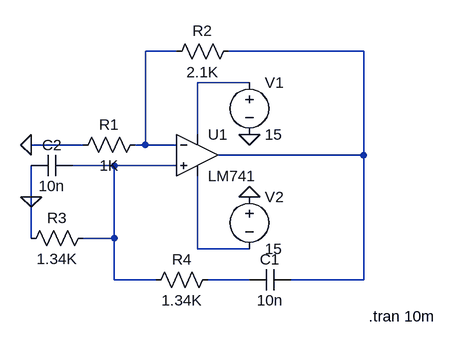
[diagram p0: schematic wein bridge (working).asc]
wein bridge (working).asc, the LTspice schematic file:
Version 4
SHEET 1 880 680
WIRE 336 144 288 144
WIRE 624 144 416 144
WIRE 448 192 368 192
WIRE 368 272 368 192
WIRE 192 288 112 288
WIRE 288 288 288 144
WIRE 288 288 272 288
WIRE 336 288 288 288
WIRE 624 304 624 144
WIRE 624 304 400 304
WIRE 240 320 176 320
WIRE 336 320 240 320
WIRE 112 368 112 320
WIRE 112 432 112 368
WIRE 240 432 240 320
WIRE 240 432 192 432
WIRE 368 448 368 336
WIRE 448 448 368 448
WIRE 240 496 240 432
WIRE 304 496 240 496
WIRE 448 496 384 496
WIRE 624 496 624 304
WIRE 624 496 512 496
FLAG 112 368 0
FLAG 112 288 0
FLAG 448 368 0
FLAG 448 272 0
SYMBOL LM741 368 240 R0
SYMATTR InstName U1
SYMBOL voltage 448 176 R0
SYMATTR InstName V1
SYMATTR Value 15
SYMBOL voltage 448 352 R0
SYMATTR InstName V2
SYMATTR Value 15
SYMBOL cap 512 480 R90
WINDOW 0 0 32 VBottom 2
WINDOW 3 32 32 VTop 2
SYMATTR InstName C1
SYMATTR Value 10n
SYMBOL cap 176 304 R90
WINDOW 0 0 32 VBottom 2
WINDOW 3 32 32 VTop 2
SYMATTR InstName C2
SYMATTR Value 10n
SYMBOL res 288 272 R90
WINDOW 0 0 56 VBottom 2
WINDOW 3 32 56 VTop 2
SYMATTR InstName R1
SYMATTR Value 1K
SYMBOL res 432 128 R90
WINDOW 0 0 56 VBottom 2
WINDOW 3 32 56 VTop 2
SYMATTR InstName R2
SYMATTR Value 2.1K
SYMBOL res 208 416 R90
WINDOW 0 0 56 VBottom 2
WINDOW 3 32 56 VTop 2
SYMATTR InstName R3
SYMATTR Value 1.34K
SYMBOL res 400 480 R90
WINDOW 0 0 56 VBottom 2
WINDOW 3 32 56 VTop 2
SYMATTR InstName R4
SYMATTR Value 1.34K
TEXT 632 552 Left 2 !.tran 10m

The netlist it stands for:
* wein bridge (working).asc
XU1 N004 N001 N003 N005 N002 LM741  ; pins In+ In- V+ V- OUT
V1 N003 0 15
V2 0 N005 15
C1 N002 N006 10n
C2 N004 0 10n
R1 N001 0 1K
R2 N002 N001 2.1K
R3 N004 0 1.34K
R4 N006 N004 1.34K
.tran 10m
.lib LM741.lib
.backanno
.end